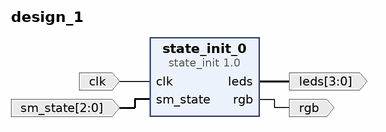
[diagram p0: block diagram of the top level]
# Vivado block design design_1, xc7z010clg400-1, Vivado 2020.1
create_bd_design design_1

create_bd_port -dir I -type clk clk
create_bd_port -dir I -from 2 -to 0 sm_state
create_bd_port -dir O rgb
create_bd_port -dir O -from 3 -to 0 leds

create_bd_cell -type ip -vlnv xilinx.com:user:state_init:1.0 state_init_0

# ---- connections ----

connect_bd_net -net clk_0_1 [get_bd_ports clk] [get_bd_pins state_init_0/clk]
connect_bd_net -net sm_state_0_1 [get_bd_ports sm_state] [get_bd_pins state_init_0/sm_state]
connect_bd_net [get_bd_pins state_init_0/rgb] [get_bd_ports rgb]
connect_bd_net [get_bd_pins state_init_0/leds] [get_bd_ports leds]

validate_bd_design
save_bd_design
